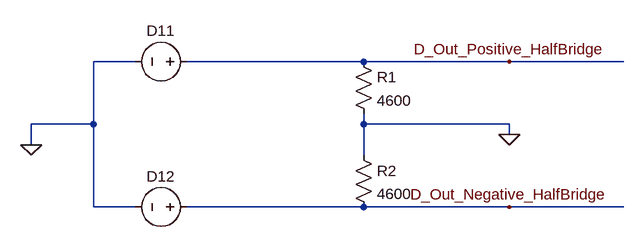
[diagram p0: schematic DataOut.asc]
DataOut.asc, the LTspice schematic file:
Version 4
SHEET 1 880 680
WIRE -400 -32 -464 -32
WIRE -48 -32 -320 -32
WIRE 176 -32 -48 -32
WIRE 352 -32 176 -32
WIRE -464 64 -464 -32
WIRE -464 64 -560 64
WIRE -48 64 -48 48
WIRE 176 64 -48 64
WIRE 176 80 176 64
WIRE -560 96 -560 64
WIRE -48 112 -48 64
WIRE -464 192 -464 64
WIRE -400 192 -464 192
WIRE -48 192 -320 192
WIRE 176 192 -48 192
WIRE 352 192 176 192
FLAG 176 192 D_Out_Negative_HalfBridge
FLAG 176 -32 D_Out_Positive_HalfBridge
FLAG 176 80 0
FLAG -560 96 0
SYMBOL res -64 -48 R0
SYMATTR InstName R1
SYMATTR Value 4600
SYMBOL res -64 96 R0
SYMATTR InstName R2
SYMATTR Value 4600
SYMBOL voltage -304 -32 R90
WINDOW 0 -32 56 VBottom 2
WINDOW 3 32 56 Invisible 2
WINDOW 123 0 0 Left 0
WINDOW 39 0 0 Left 0
SYMATTR InstName D11
SYMATTR Value PWL(0 5 400u 5 401u 0 800u 0)
SYMBOL voltage -304 192 R90
WINDOW 0 -32 56 VBottom 2
WINDOW 3 32 56 Invisible 2
WINDOW 123 0 0 Left 0
WINDOW 39 0 0 Left 0
SYMATTR InstName D12
SYMATTR Value PWL(0 0 400u 0 401u 5 800u 5)

The netlist it stands for:
* DataOut.asc
R1 D_Out_Positive_HalfBridge 0 4600
R2 0 D_Out_Negative_HalfBridge 4600
V§D11 D_Out_Positive_HalfBridge 0 PWL(0 5 400u 5 401u 0 800u 0)
V§D12 D_Out_Negative_HalfBridge 0 PWL(0 0 400u 0 401u 5 800u 5)
.backanno
.end